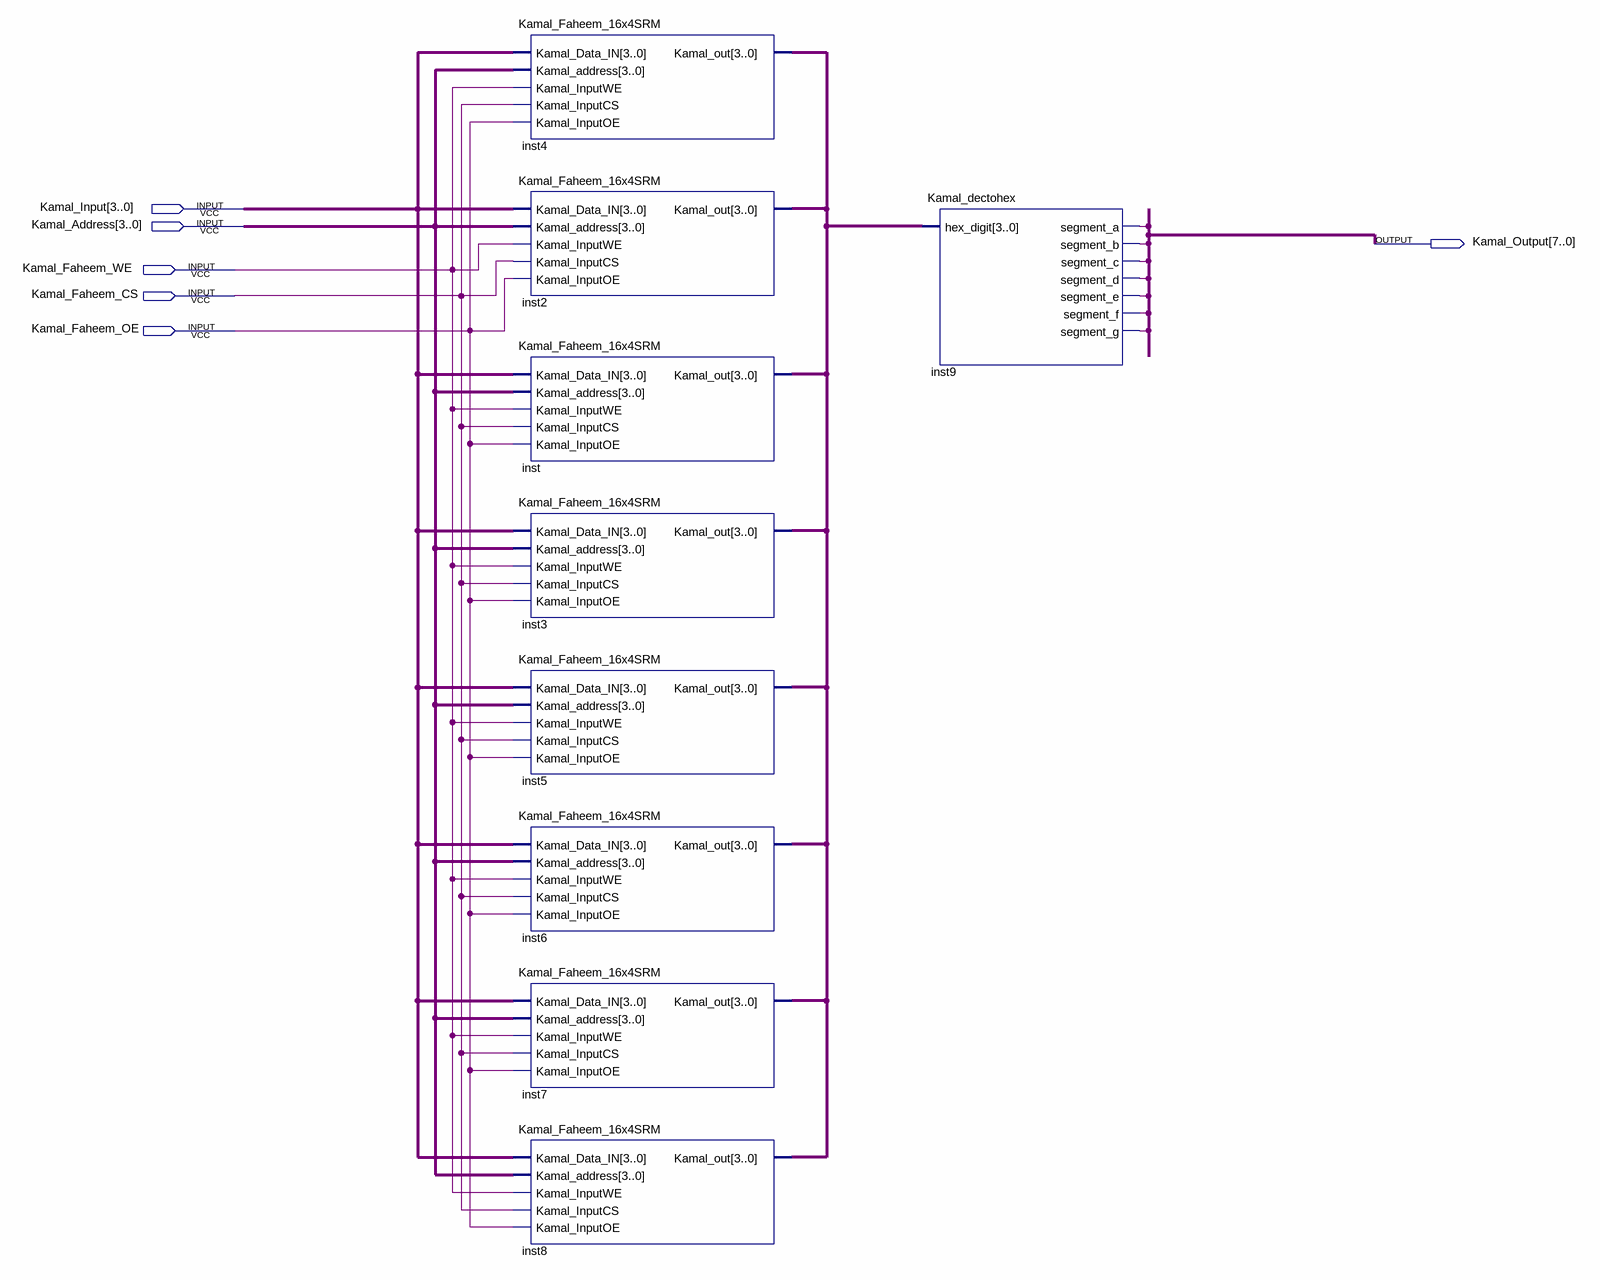
[diagram p0: schematic sheet]
// Quartus schematic Kamal_Faheem_16x32SRAMwithDectoHex.bdf as structural Verilog: 9 symbols, 6 pins
module Kamal_Faheem_16x32SRAMwithDectoHex (
  input  [3:0] Kamal_Input,
  input  [3:0] Kamal_Address,
  input  Kamal_Faheem_WE,
  input  Kamal_Faheem_CS,
  input  Kamal_Faheem_OE,
  output [7:0] Kamal_Output
);

  wire inst9_segment_a, inst9_segment_b, inst9_segment_c, inst9_segment_d, inst9_segment_e, inst9_segment_f,
       inst9_segment_g;
  wire [3:0] inst4_kamal_out;

  Kamal_Faheem_16x4SRM inst4 (
    .Kamal_Data_IN(Kamal_Input), .Kamal_address(Kamal_Address), .Kamal_InputWE(Kamal_Faheem_WE),
    .Kamal_InputCS(Kamal_Faheem_CS), .Kamal_InputOE(Kamal_Faheem_OE), .Kamal_out(inst4_kamal_out));
  Kamal_Faheem_16x4SRM inst2 (
    .Kamal_Data_IN(Kamal_Input), .Kamal_address(Kamal_Address), .Kamal_InputWE(Kamal_Faheem_WE),
    .Kamal_InputCS(Kamal_Faheem_CS), .Kamal_InputOE(Kamal_Faheem_OE), .Kamal_out(inst4_kamal_out));
  Kamal_Faheem_16x4SRM inst (
    .Kamal_Data_IN(Kamal_Input), .Kamal_address(Kamal_Address), .Kamal_InputWE(Kamal_Faheem_WE),
    .Kamal_InputCS(Kamal_Faheem_CS), .Kamal_InputOE(Kamal_Faheem_OE), .Kamal_out(inst4_kamal_out));
  Kamal_Faheem_16x4SRM inst3 (
    .Kamal_Data_IN(Kamal_Input), .Kamal_address(Kamal_Address), .Kamal_InputWE(Kamal_Faheem_WE),
    .Kamal_InputCS(Kamal_Faheem_CS), .Kamal_InputOE(Kamal_Faheem_OE), .Kamal_out(inst4_kamal_out));
  Kamal_Faheem_16x4SRM inst5 (
    .Kamal_Data_IN(Kamal_Input), .Kamal_address(Kamal_Address), .Kamal_InputWE(Kamal_Faheem_WE),
    .Kamal_InputCS(Kamal_Faheem_CS), .Kamal_InputOE(Kamal_Faheem_OE), .Kamal_out(inst4_kamal_out));
  Kamal_Faheem_16x4SRM inst6 (
    .Kamal_Data_IN(Kamal_Input), .Kamal_address(Kamal_Address), .Kamal_InputWE(Kamal_Faheem_WE),
    .Kamal_InputCS(Kamal_Faheem_CS), .Kamal_InputOE(Kamal_Faheem_OE), .Kamal_out(inst4_kamal_out));
  Kamal_Faheem_16x4SRM inst7 (
    .Kamal_Data_IN(Kamal_Input), .Kamal_address(Kamal_Address), .Kamal_InputWE(Kamal_Faheem_WE),
    .Kamal_InputCS(Kamal_Faheem_CS), .Kamal_InputOE(Kamal_Faheem_OE), .Kamal_out(inst4_kamal_out));
  Kamal_Faheem_16x4SRM inst8 (
    .Kamal_Data_IN(Kamal_Input), .Kamal_address(Kamal_Address), .Kamal_InputWE(Kamal_Faheem_WE),
    .Kamal_InputCS(Kamal_Faheem_CS), .Kamal_InputOE(Kamal_Faheem_OE), .Kamal_out(inst4_kamal_out));
  Kamal_dectohex inst9 (
    .hex_digit(inst4_kamal_out), .segment_a(inst9_segment_a), .segment_b(inst9_segment_b),
    .segment_c(inst9_segment_c), .segment_d(inst9_segment_d), .segment_e(inst9_segment_e),
    .segment_f(inst9_segment_f), .segment_g(inst9_segment_g));
endmodule
